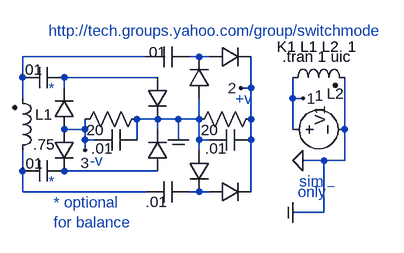
[diagram p0: schematic bridge-v-doubler.asc]
bridge-v-doubler.asc, the LTspice schematic file:
Version 4
SHEET 1 1624 1340
WIRE -432 -96 -624 -96
WIRE -352 -96 -368 -96
WIRE -336 -96 -352 -96
WIRE -624 -64 -624 -96
WIRE -416 -64 -560 -64
WIRE -560 -48 -560 -64
WIRE -272 -48 -272 -96
WIRE -272 -48 -288 -48
WIRE -624 -32 -624 -64
WIRE -208 -32 -208 -64
WIRE -192 -32 -208 -32
WIRE -416 0 -448 0
WIRE -384 0 -416 0
WIRE -352 0 -352 -32
WIRE -352 0 -384 0
WIRE -272 0 -272 -48
WIRE -528 16 -528 0
WIRE -528 16 -560 16
WIRE -416 16 -416 0
WIRE -208 16 -208 -32
WIRE -128 16 -128 -64
WIRE -528 32 -528 16
WIRE -512 32 -528 32
WIRE -448 32 -448 0
WIRE -384 32 -384 0
WIRE -352 32 -352 0
WIRE -336 32 -352 32
WIRE -272 32 -272 0
WIRE -528 48 -528 32
WIRE -352 48 -352 32
WIRE -160 64 -192 64
WIRE -128 64 -128 16
WIRE -128 64 -160 64
WIRE -624 80 -624 48
WIRE -416 80 -560 80
WIRE -624 112 -624 80
WIRE -432 112 -624 112
WIRE -352 112 -368 112
WIRE -336 112 -352 112
WIRE -272 112 -272 32
WIRE -160 144 -160 64
WIRE -160 144 -208 144
FLAG -288 -48 2
FLAG -192 -32 1
FLAG -208 144 COM
FLAG -528 48 3
FLAG -192 64 0
FLAG -384 32 COM
SYMBOL ind2 -640 64 M180
WINDOW 0 35 71 Left 0
WINDOW 3 32 25 Left 0
SYMATTR InstName L1
SYMATTR Value .75
SYMATTR SpiceLine Rser=.01
SYMBOL voltage -224 16 R270
WINDOW 3 24 104 Invisible 0
WINDOW 123 0 0 Left 0
WINDOW 0 7 58 Left 0
SYMATTR Value SINE(0 160 60 0 0 0 1500)
SYMATTR InstName V1
SYMATTR SpiceLine Rser=.01
SYMBOL ind2 -224 -48 R270
WINDOW 0 -24 82 VTop 0
WINDOW 3 4 57 VBottom 0
SYMATTR InstName L2
SYMATTR Value 1
SYMBOL res -256 -16 R90
WINDOW 0 0 56 Invisible 0
WINDOW 3 17 80 VTop 0
SYMATTR InstName R6
SYMATTR Value 20
SYMBOL cap -432 128 R270
WINDOW 0 32 32 Invisible 0
WINDOW 3 16 14 VBottom 0
SYMATTR InstName C1
SYMATTR Value .01
SYMBOL diode -336 -80 R270
WINDOW 0 28 62 Invisible 0
WINDOW 3 66 38 Invisible 0
SYMATTR InstName D7
SYMATTR Value MUR460
SYMBOL cap -432 -80 R270
WINDOW 0 32 32 Invisible 0
WINDOW 3 39 13 VBottom 0
SYMATTR InstName C4
SYMATTR Value .01
SYMBOL diode -544 16 M0
WINDOW 0 10 18 Invisible 0
WINDOW 3 24 72 Invisible 0
SYMATTR InstName D9
SYMATTR Value MUR460
SYMBOL diode -576 16 M180
WINDOW 0 24 72 Invisible 0
WINDOW 3 24 0 Invisible 0
SYMATTR InstName D1
SYMATTR Value MUR460
SYMBOL diode -336 128 R270
WINDOW 0 28 62 Invisible 0
WINDOW 3 66 38 Invisible 0
SYMATTR InstName D3
SYMATTR Value MUR460
SYMBOL diode -368 -32 M180
WINDOW 0 24 72 Invisible 0
WINDOW 3 24 0 Invisible 0
SYMATTR InstName D5
SYMATTR Value MUR460
SYMBOL diode -336 48 M0
WINDOW 0 10 18 Invisible 0
WINDOW 3 24 72 Invisible 0
SYMATTR InstName D6
SYMATTR Value MUR460
SYMBOL diode -400 -64 M0
WINDOW 0 10 18 Invisible 0
WINDOW 3 24 72 Invisible 0
SYMATTR InstName D8
SYMATTR Value MUR460
SYMBOL diode -432 80 M180
WINDOW 0 24 72 Invisible 0
WINDOW 3 24 0 Invisible 0
SYMATTR InstName D10
SYMATTR Value MUR460
SYMBOL cap -336 48 R270
WINDOW 0 32 32 Invisible 0
WINDOW 3 18 10 VBottom 0
SYMATTR InstName C5
SYMATTR Value .01
SYMBOL cap -624 -48 R270
WINDOW 0 32 32 Invisible 0
WINDOW 3 44 14 VBottom 0
SYMATTR InstName C6
SYMATTR Value .01
SYMBOL cap -624 96 R270
WINDOW 0 32 32 Invisible 0
WINDOW 3 43 15 VBottom 0
SYMATTR InstName C7
SYMATTR Value .01
SYMBOL cap -512 48 R270
WINDOW 0 32 32 Invisible 0
WINDOW 3 18 10 VBottom 0
SYMATTR InstName C2
SYMATTR Value .01
SYMBOL res -432 -16 R90
WINDOW 0 0 56 Invisible 0
WINDOW 3 17 80 VTop 0
SYMATTR InstName R1
SYMATTR Value 20
TEXT -224 -96 Left 0 !.tran 1 uic
TEXT -232 -112 Left 0 !K1 L1 L2  1
TEXT -584 -136 Left 0 ;http://tech.groups.yahoo.com/group/switchmode
TEXT -160 96 Right 0 ;sim
TEXT -200 112 Left 0 ;only
TEXT -576 128 Left 0 ;* optional\nfor balance
TEXT -584 -48 Left 0 ;*
TEXT -584 96 Left 0 ;*
TEXT -520 64 Left 0 ;-v
TEXT -296 -32 Left 0 ;+v
LINE Normal -176 104 -144 104 1

The netlist it stands for:
* bridge-v-doubler.asc
L1 N004 N001 .75 Rser=.01
V1 1 0 SINE(0 160 60 0 0 0 1500) Rser=.01
L2 1 0 1
R6 2 0 20
C1 N004 N006 .01
D7 N002 2 MUR460
C4 N001 N002 .01
D9 3 N005 MUR460
D1 3 N003 MUR460
D3 N006 2 MUR460
D5 0 N002 MUR460
D6 0 N006 MUR460
D8 N003 0 MUR460
D10 N005 0 MUR460
C5 0 2 .01
C6 N001 N003 .01
C7 N004 N005 .01
C2 3 0 .01
R1 0 3 20
.model D D
.lib standard.dio
.tran 1 uic
K1 L1 L2  1
* http://tech.groups.yahoo.com/group/switchmode
* sim
* only
* * optional
* for balance
* *
* *
* -v
* +v
.backanno
.end